# Altium project Asad's RGB Clock.PrjPcb
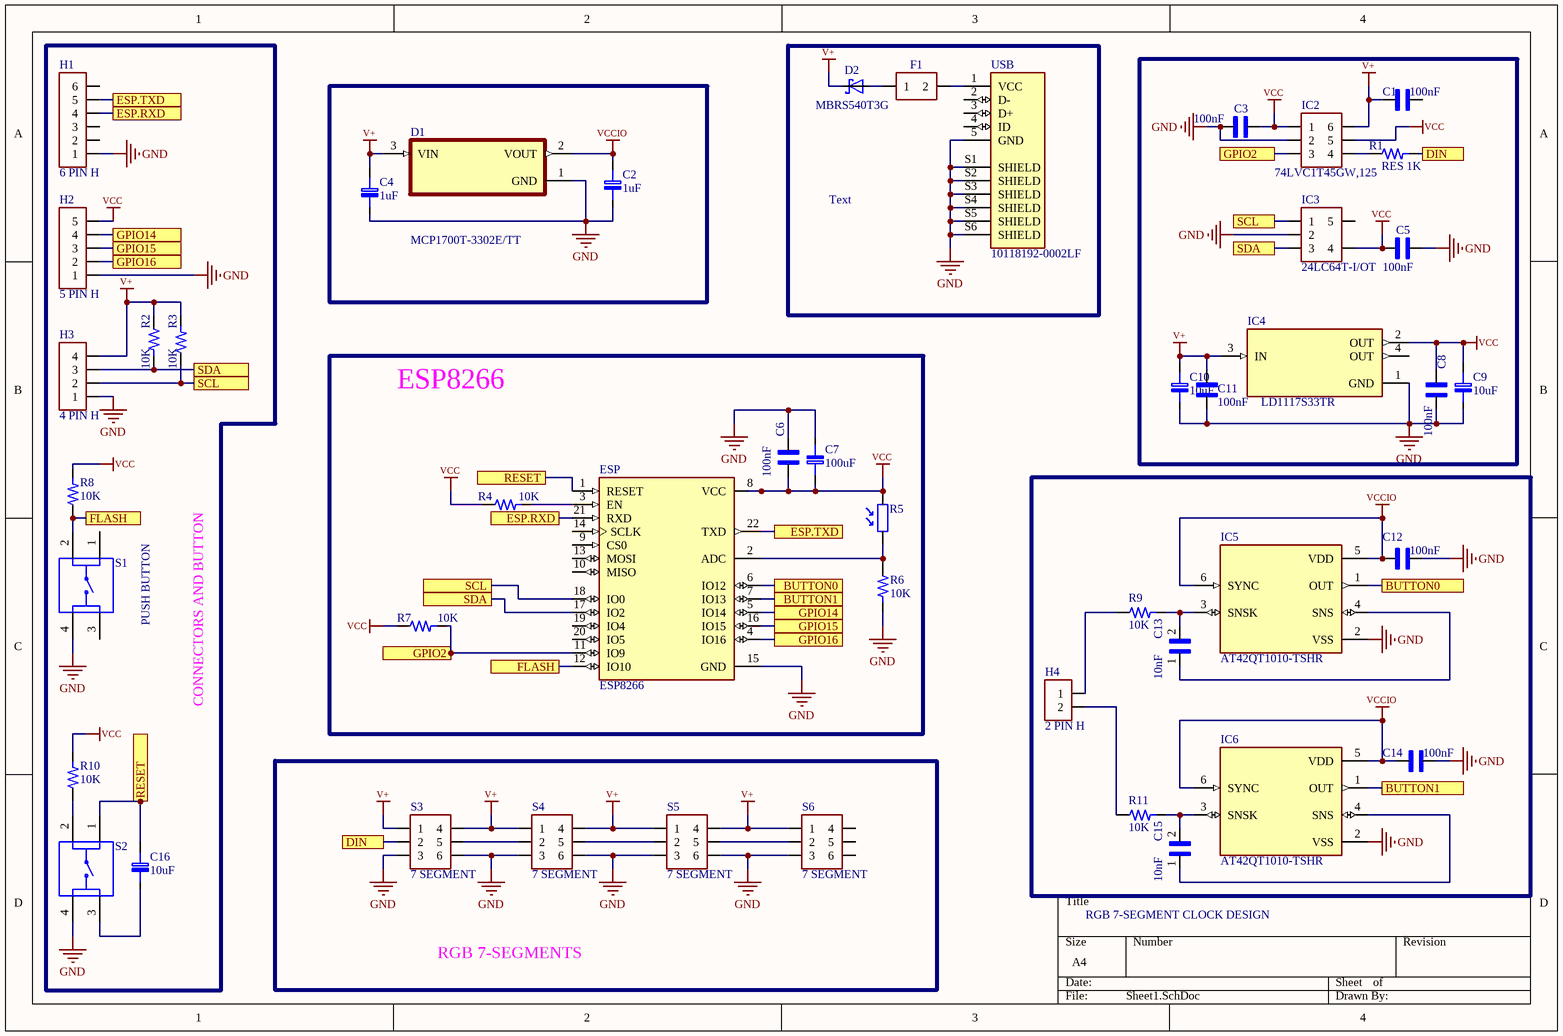
[diagram p0: Sheet1.SchDoc]
1 sheet, 47 parts. Net scope: flat (ports and power ports of the same name join across sheets).
Board file: PCB1.PcbDoc

## Sheet Sheet1.SchDoc
size A4

### Parts
C1  100nF  [CAP 0805]
C2  1uF  [CAP 0603]
C3  100nF  [CAP 0805]
C4  1uF  [CAP 0603]
C5  100nF  [CAP 0805]
C6  100nF  [CAP 0805]
C7  100uF  [CAP 2312]
C8  100nF  [CAP 0805]
C9  10uF  [CAP 1206]
C10  10uF  [CAP 1206]
C11  100nF  [CAP 0805]
C12  100nF  [CAP 0805]
C13  10nF  [CAP 0805]
C14  100nF  [CAP 0805]
C15  10nF  [CAP 0805]
C16  10uF  [CAP 1206]
D1  MCP1700T-3302E/TT  [MCP1700]
D2  MBRS540T3G  [MBRS50]
ESP  ESP8266  [ESP8266]
F1  MF-SMDF200-2  [MF-SMDF200-2]  (value not drawn)
H1  6 PIN H  [6 PIN H]
H2  5 PIN H  [5 PIN H]
H3  4 PIN H  [4 PIN H]
H4  2 PIN H  [2 PIN H]
IC2  74LVC1T45GW,125  [74LVC1T45GW,125]
IC3  24LC64T-I/OT  [24LC64T-I/OT]
IC4  LD1117S33TR  [LD1117S33TR]
IC5  AT42QT1010-TSHR  [AT42QT1010-TSHR]
IC6  AT42QT1010-TSHR  [AT42QT1010-TSHR]
R1  RES 1K  [RES 1206]
R2  10K  [RES 1206]
R3  10K  [RES 1206]
R4  10K  [RES 1206]
R5  NSL 19M51.  [NSL-19M51]  (value not drawn)
R6  10K  [RES 1206]
R7  10K  [RES 1206]
R8  10K  [RES 1206]
R9  10K  [RES 1206]
R10  10K  [RES 1206]
R11  10K  [RES 1206]
S1  PUSH BUTTON  [PUSH BUTTON]
S2  PUSH BUTTON  [PUSH BUTTON]  (value not drawn)
S3  7 SEGMENT  [7 SEGMENT]
S4  7 SEGMENT  [7 SEGMENT]
S5  7 SEGMENT  [7 SEGMENT]
S6  7 SEGMENT  [7 SEGMENT]
USB  10118192-0002LF  [10118192-0002LF]

### Ports
BUTTON0, BUTTON1, DIN, ESP.RXD, ESP.TXD, FLASH, GPIO2, GPIO14, GPIO15, GPIO16, RESET, SCL, SDA

### Nets
GND: C2.2 C3.1 C4.2 C5.2 C6.2 C7.2 C8.1 C9.2 C10.2 C11.1 C12.2 C14.2 D1.1(GND) ESP.15(GND) H1.1 H2.1 H3.1 IC2.2 IC3.2 IC4.1(GND) IC5.2(VSS) IC6.2(VSS) R6.2 S1.4 S2.4 S3.3 S3.6 S4.3 S4.6 S5.3 S5.6 S6.3 USB.5(GND) USB.S1(SHIELD) USB.S2(SHIELD) USB.S3(SHIELD) USB.S4(SHIELD) USB.S5(SHIELD) USB.S6(SHIELD)
V+: C1.1 C4.1 C10.1 C11.2 D1.3(VIN) D2.C H3.4 IC2.6 IC4.3(IN) R2.1 R3.2 S3.1 S3.4 S4.1 S4.4 S5.1 S5.4 S6.1
VCC: C3.2 C5.1 C6.1 C7.1 C8.2 C9.1 ESP.8(VCC) H2.5 IC2.1 IC2.5 IC3.4 IC4.2(OUT) R4.1 R5.2 R7.1 R8.2 R10.2
VCCIO: C2.1 C12.1 C14.1 D1.2(VOUT) IC5.5(VDD) IC5.6(SYNC) IC6.5(VDD) IC6.6(SYNC)
NetC13_1: C13.1 IC5.4(SNS)
NetC13_2: C13.2 IC5.3(SNSK) R9.2
NetC15_1: C15.1 IC6.4(SNS)
NetC15_2: C15.2 IC6.3(SNSK) R11.2
NetC16_1: C16.1 ESP.1(RESET) S2.1 ; port RESET
NetC16_2: C16.2 S2.3
NetD2_A: D2.A F1.1
NetESP_2: ESP.2(ADC) R5.1 R6.1
NetESP_3: ESP.3(EN) R4.2
NetESP_4: ESP.4(IO16) H2.2 ; port GPIO16
NetESP_5: ESP.5(IO14) H2.4 ; port GPIO14
NetESP_6: ESP.6(IO12) IC5.1(OUT) ; port BUTTON0
NetESP_7: ESP.7(IO13) IC6.1(OUT) ; port BUTTON1
NetESP_11: ESP.11(IO9) IC2.3 R7.2 ; port GPIO2
NetESP_12: ESP.12(IO10) R8.1 S1.2 ; port FLASH
NetESP_16: ESP.16(IO15) H2.3 ; port GPIO15
NetESP_17: ESP.17(IO2) H3.3 IC3.3 R2.2 ; port SDA
NetESP_18: ESP.18(IO0) H3.2 IC3.1 R3.1 ; port SCL
NetESP_21: ESP.21(RXD) H1.4 ; port ESP.RXD
NetESP_22: ESP.22(TXD) H1.5 ; port ESP.TXD
NetF1_2: F1.2 USB.1(VCC)
NetH4_1: H4.1 R9.1
NetH4_2: H4.2 R11.1
NetIC2_4: IC2.4 R1.1
NetR1_2: R1.2 S3.2 ; port DIN
NetR10_1: R10.1 S2.2
NetS3_5: S3.5 S4.2
NetS4_5: S4.5 S5.2
NetS5_5: S5.5 S6.2

Not connected (* = marked no-connect by the designer): C1 2; ESP 9(CS0) 10(MISO) 13(MOSI) 14(SCLK) 19(IO4) 20(IO5); H1 2 3 6; IC3 5; IC4 4(OUT); S1 1 3; S6 4 5 6; USB 2(D-) 3(D+) 4(ID)

### Notes on the sheet
- Text
- ESP8266
- CONNECTORS AND BUTTON
- RGB 7-SEGMENT CLOCK DESIGN
- RGB 7-SEGMENTS

### Library data of the parts
C1 C3 C5 C6 C8 C11 C12 C14 = CAP 100nF
C2 C4 = CAP 1 uF 50V: SAMSUNG ELECTRO-MECHANICS - CL21B105KBFNNNG - MLCC CAPACITORS; Material: Ceramic; Tolerance: 10%; Voltage Rating: 50V; Dielectric: X7R; Supplier 1: Digi-Key; Manufacturer: Samsung; Manufacturer Part Number: CL21B105KBFNNNG; RoHS: Yes; Category: Ceramic Capacitors; Stock 1: 1584886; Pricing 1: 1=0.12000, 10=0.08900, 50=0.05020, 100=0.04160, 500=0.02918, 1000=0.02416 (USD); Mount: Surface Mount; Case/Package: 0805; Case Code (Metric): 2012; Case Code (Imperial): 0805; Contact Plating: Tin; Min Operating Temperature: -55°C; Max Operating Temperature: 125°C; Packaging: Tape and Reel; Capacitance: 1uF; Package Quantity: 3000; Termination: Wraparound; Voltage: 50V; Series: CL; Construction: Flat; Length: 2mm; Width: 0.049inch; Thickness: 0.053inch; Depth: 1.25mm; RoHS Compliant: Yes; ComponentLink1URL: https://datasheet.ciiva.com/25733/cl21b105kbfnnng-25733278.pdf?src-supplier=Digi-Key; ComponentLink1Description: https://datasheet.ciiva.com/25733/cl21b105kbfnnng-25733278.pdf?src-supplier=Digi-Key; ComponentLink2URL: https://datasheet.ciiva.com/29199/455898-da-01-en-vs-kondensator-0805-29199201.pdf?src-supplier=Conrad; ComponentLink2Description: https://datasheet.ciiva.com/29199/455898-da-01-en-vs-kondensator-0805-29199201.pdf?src-supplier=Conrad; ComponentLink3URL: https://datasheet.ciiva.com/26310/mlcc-catalogdownload2013-eng-26310125.pdf?src-supplier=Distrelec; ComponentLink3Description: https://datasheet.ciiva.com/26310/mlcc-catalogdownload2013-eng-26310125.pdf?src-supplier=Distrelec; ComponentLink4URL: https://datasheet.ciiva.com/16428/cl05b104kq5nnnc-16428872.pdf?src-supplier=Future+Electronics; ComponentLink4Description: https://datasheet.ciiva.com/16428/cl05b104kq5nnnc-16428872.pdf?src-supplier=Future+Electronics; Supplier Part Number 1: 1276-6470-1-ND
C7 = CAP 100uF 16V: Cap Tant Solid 100uf 16V C Case (6.0x3.2x2.5mm) 10% SMD 200 mOhm 125C T/R; Manufacturer: KEMET; Manufacturer Part Number: T495C107K016ATE200; ESR (Equivalent Series Resistance): 200mR; Life (Hours): 2000Hour; Supplier 1: Digi-Key; RoHS: Yes; Category: Tantalum Capacitors; Stock 1: 4587; Pricing 1: 1=1.73000, 10=1.36900, 50=1.18600, 100=1.02640 (USD); Mount: Surface Mount; Case/Package: 2413; Case Code (Metric): 6032; Case Code (Imperial): 2413; Min Operating Temperature: -55°C; Max Operating Temperature: 125°C; Package Quantity: 1; Packaging: Cut Tape; Capacitance: 100uF; Tolerance: 10%; Voltage Rating: 16V; Voltage Rating (DC): 16V; Features: General Purpose; Length: 0.236inch; Width: 0.126inch; Height: 2.5mm; Height - Seated (Max): 0.11inch; Depth: 3.2mm; Radiation Hardening: No; REACH SVHC: Unknown; Lead Free: Lead Free; RoHS Compliant: Yes; ComponentLink1URL: http://www.farnell.com/datasheets/2373561.pdf?src-supplier=Farnell; ComponentLink1Description: http://www.farnell.com/datasheets/2373561.pdf?src-supplier=Farnell; ComponentLink2URL: http://www.farnell.com/datasheets/2758439.pdf?src-supplier=Newark; ComponentLink2Description: http://www.farnell.com/datasheets/2758439.pdf?src-supplier=Newark; ComponentLink3URL: http://www.farnell.com/datasheets/2015701.pdf?src-supplier=Element14; ComponentLink3Description: http://www.farnell.com/datasheets/2015701.pdf?src-supplier=Element14; ComponentLink4URL: http://www.farnell.com/datasheets/2373561.pdf?src-supplier=Newark; ComponentLink4Description: http://www.farnell.com/datasheets/2373561.pdf?src-supplier=Newark; ComponentLink5URL: https://api.kemet.com/component-edge/download/datasheet/T495C107K016ATE200.pdf?src-supplier=Digi-Key; ComponentLink5Description: https://api.kemet.com/component-edge/download/datasheet/T495C107K016ATE200.pdf?src-supplier=Digi-Key; ComponentLink6URL: http://capacitoredge.kemet.com/capedge2/DataSheet/Datasheet-T495C107K016ATE200.pdf?pn=T495C107K016ATE200&src-supplier=Avnet; ComponentLink6Description: http://capacitoredge.kemet.com/capedge2/DataSheet/Datasheet-T495C107K016ATE200.pdf?pn=T495C107K016ATE200&src-supplier=Avnet; Supplier Part Number 1: 399-11392-1-ND
C9 C10 C16 = CAP 10uF 10V: Cap Ceramic 10uF 10V X5R 10% SMD 1206 85C T/R; Manufacturer: Samsung; Manufacturer Part Number: CL31A106KPHNNNE; Supplier 1: Digi-Key; RoHS: Yes; Category: Ceramic Capacitors; Stock 1: 176788; Pricing 1: 1=0.23000, 10=0.15900, 50=0.09540, 100=0.08060, 500=0.05516, 1000=0.04880 (USD); Mount: Surface Mount; Case/Package: 1206; Case Code (Metric): 3216; Case Code (Imperial): 1206; Contact Plating: Tin; Min Operating Temperature: -55°C; Max Operating Temperature: 85°C; Packaging: Tape and Reel; Capacitance: 10uF; Tolerance: 10%; Voltage Rating: 10V; Dielectric: X5R; Series: CL; Construction: Flat; Length: 3.2mm; Width: 0.063inch; Height: 1.6mm; Thickness: 0.071inch; Depth: 1.6mm; Radiation Hardening: No; RoHS Compliant: Yes; ComponentLink1URL: https://datasheet.ciiva.com/15195/getdatasheetpartid-357468-15195994.pdf?src-supplier=Verical; ComponentLink1Description: https://datasheet.ciiva.com/15195/getdatasheetpartid-357468-15195994.pdf?src-supplier=Verical; ComponentLink2URL: https://datasheet.ciiva.com/16224/cl31a106kphnnne-16224988.pdf?src-supplier=Future+Electronics; ComponentLink2Description: https://datasheet.ciiva.com/16224/cl31a106kphnnne-16224988.pdf?src-supplier=Future+Electronics; Supplier Part Number 1: 1276-1148-1-ND
C13 C15 = CAP 10nF 50V: SAMSUNG ELECTRO-MECHANICS - CL21B103KBANNNC - SMD Vícevrstvý Keramický Kondenzátor, 10000 pF, 50 V, 0805 [2012 Metrické], ± 10%, X7R, CL Series; Material: Ceramic; Voltage Rating (DC): 50V; Supplier 1: Digi-Key; Manufacturer: Samsung; Manufacturer Part Number: CL21B103KBANNNC; RoHS: Yes; Category: Ceramic Capacitors; Stock 1: 930321; Pricing 1: 1=0.10000, 10=0.04700, 50=0.02560, 100=0.02100, 500=0.01498, 1000=0.01176 (USD); Mount: Surface Mount; Case/Package: 0805; Case Code (Metric): 2012; Case Code (Imperial): 0805; Contact Plating: Tin; Min Operating Temperature: -55°C; Max Operating Temperature: 125°C; Capacitance: 10nF; Tolerance: 10%; Dielectric: X7R; Voltage: 50V; Packaging: Tape and Reel; Voltage Rating: 50V; Series: CL; Construction: Flat; Length: 2mm; Width: 0.049inch; Height: 0.65mm; Depth: 1.25mm; Thickness: 0.03inch; Radiation Hardening: No; Lead Free: Lead Free; RoHS Compliant: Yes; ComponentLink1URL: https://datasheet.ciiva.com/25709/cl21b103kbannnc-25709781.pdf?src-supplier=Digi-Key; ComponentLink1Description: https://datasheet.ciiva.com/25709/cl21b103kbannnc-25709781.pdf?src-supplier=Digi-Key; ComponentLink2URL: https://datasheet.ciiva.com/29199/455082-da-01-en-vs-kondensator-0805-29199459.pdf?src-supplier=Conrad; ComponentLink2Description: https://datasheet.ciiva.com/29199/455082-da-01-en-vs-kondensator-0805-29199459.pdf?src-supplier=Conrad; Supplier Part Number 1: 1276-1015-1-ND
D1 = MCP1700T-3302E/TT: Pwr Sply Func; Voltage Regulator; LDO; SOT-23; PD 369.6mW; VO 3.3V; Regline +/-0.75%/V; Manufacturer: Microchip; Number of Outputs: 1; Min Input Voltage: 2.3V; Max Input Voltage: 6V; Dropout Voltage: 178mV; Output Current: 250mA; Input Bias Current: 1.6uA; Polarity: Positive; Quiescent Current: 4uA; Accuracy: 2%; Output Type: Fixed; Supplier 1: RSComponents; Manufacturer Part Number: MCP1700T-3302E/TT; RoHS: Yes; Category: Voltage Regulators - Linear; Stock 1: 1170; Pricing 1: 1=0.40600 (USD); Mount: Surface Mount; Case/Package: SOT-23; Number of Pins: 3; Contact Plating: Tin,Matte; Min Operating Temperature: -40°C; Max Operating Temperature: 125°C; Nominal Output Voltage: 3.3V; Packaging: Tape and Reel; Output Voltage: 3.3V; Max Output Current: 250mA; Max Supply Voltage: 6V; Min Supply Voltage: 2.3V; Package Quantity: 3000; Max Power Dissipation: 369.6mW; Min Output Voltage: 3.3V; Max Output Voltage: 3.3V; Termination: SMD/SMT; Output Voltage Accuracy: 2%; Nominal Supply Current: 4uA; Power Dissipation: 369.6mW; Length: 2.9mm; Width: 1.3mm; Height: 0.95mm; Radiation Hardening: No; REACH SVHC: No SVHC; Lead Free: Lead Free; ComponentLink1URL: https://datasheet.ciiva.com/2040/21826b-2040112.pdf?src-supplier=Digi-Key; ComponentLink1Description: https://datasheet.ciiva.com/2040/21826b-2040112.pdf?src-supplier=Digi-Key; ComponentLink2URL: https://datasheet.ciiva.com/5801/1784514-5801824.pdf?src-supplier=Farnell; ComponentLink2Description: https://datasheet.ciiva.com/5801/1784514-5801824.pdf?src-supplier=Farnell; ComponentLink3URL: https://datasheet.ciiva.com/2040/21826b-2040113.pdf?src-supplier=Digi-Key; ComponentLink3Description: https://datasheet.ciiva.com/2040/21826b-2040113.pdf?src-supplier=Digi-Key; ComponentLink4URL: https://datasheet.ciiva.com/2040/21826b-2040114.pdf?src-supplier=Digi-Key; ComponentLink4Description: https://datasheet.ciiva.com/2040/21826b-2040114.pdf?src-supplier=Digi-Key; ComponentLink5URL: https://datasheet.ciiva.com/3224/jp011779-3224133.pdf?src-supplier=Avnet; ComponentLink5Description: https://datasheet.ciiva.com/3224/jp011779-3224133.pdf?src-supplier=Avnet; ComponentLink6URL: https://datasheet.ciiva.com/7649/1784514-7649813.pdf?src-supplier=Element14; ComponentLink6Description: https://datasheet.ciiva.com/7649/1784514-7649813.pdf?src-supplier=Element14; ComponentLink7URL: https://datasheet.ciiva.com/15200/getdatasheetpartid-453599-15200229.pdf?src-supplier=Verical; ComponentLink7Description: https://datasheet.ciiva.com/15200/getdatasheetpartid-453599-15200229.pdf?src-supplier=Verical; ComponentLink8URL: https://datasheet.ciiva.com/17364/jp011779-17364263.pdf?src-supplier=Avnet+Europe; ComponentLink8Description: https://datasheet.ciiva.com/17364/jp011779-17364263.pdf?src-supplier=Avnet+Europe; ComponentLink9URL: https://datasheet.ciiva.com/14150/mcp1700-eng-tds-14150122.pdf?src-supplier=Distrelec; ComponentLink9Description: https://datasheet.ciiva.com/14150/mcp1700-eng-tds-14150122.pdf?src-supplier=Distrelec; ComponentLink10URL: https://datasheet.ciiva.com/22710/1784514-22710988.pdf?src-supplier=Element14; ComponentLink10Description: https://datasheet.ciiva.com/22710/1784514-22710988.pdf?src-supplier=Element14; ComponentLink11URL: https://datasheet.ciiva.com/29305/651414-da-01-en-ic-reg-ld-mcp1700t-3302e-tt-sot-23-3-mcp-29305258.pdf?src-supplier=Conrad; ComponentLink11Description: https://datasheet.ciiva.com/29305/651414-da-01-en-ic-reg-ld-mcp1700t-3302e-tt-sot-23-3-mcp-29305258.pdf?src-supplier=Conrad; Supplier Part Number 1: 6989044P
D2 = MBRS540T3G: ON SEMICONDUCTOR - MBRS540T3G - Schottky Rectifier, 40 V, 5 A, Single, DO-214AB (SMC), 2 Pins, 500 mV; Max Surge Current: 190A; Forward Current: 5A; Max Reverse Current: 300uA; Forward Voltage: 500mV; Max Repetitive Reverse Voltage (Vrrm): 40V; Polarity: Standard; Supplier 1: Newark; Manufacturer: ON Semiconductor; Manufacturer Part Number: MBRS540T3G; RoHS: Yes; Category: Rectifier Diodes; Stock 1: 89; Pricing 1: 5=0.51800, 10=0.44800, 100=0.31900, 500=0.25500 (USD); Case/Package: SMC; Number of Pins: 2; Contact Plating: Tin,Matte; Min Operating Temperature: -65°C; Max Operating Temperature: 150°C; Package Quantity: 2500; Packaging: Tape and Reel; Average Rectified Current: 5A; Max Reverse Leakage Current: 300uA; Max Forward Surge Current (Ifsm): 190A; Peak Non-Repetitive Surge Current: 190A; Element Configuration: Single; Voltage Rating (DC): 40V; Current Rating: 5A; Output Current: 5A; Max Reverse Voltage (DC): 40V; Series: -; Length: 0.279inch; Width: 0.24inch; Height: 0.095inch; Radiation Hardening: No; REACH SVHC: No SVHC; Lead Free: Lead Free; Halogen Free: Halogen Free; RoHS Compliant: Yes; ComponentLink1URL: https://datasheet.ciiva.com/916/mbrs540t3-d-916082.pdf?src-supplier=Digi-Key; ComponentLink1Description: https://datasheet.ciiva.com/916/mbrs540t3-d-916082.pdf?src-supplier=Digi-Key; ComponentLink2URL: https://datasheet.ciiva.com/16225/mbrs540t3-d-16225604.pdf?src-supplier=Future+Electronics; ComponentLink2Description: https://datasheet.ciiva.com/16225/mbrs540t3-d-16225604.pdf?src-supplier=Future+Electronics; ComponentLink3URL: https://datasheet.ciiva.com/22659/1708285-22659081.pdf?src-supplier=Element14; ComponentLink3Description: https://datasheet.ciiva.com/22659/1708285-22659081.pdf?src-supplier=Element14; ComponentLink4URL: https://datasheet.ciiva.com/916/mbrs540t3-d-916083.pdf?src-supplier=Digi-Key; ComponentLink4Description: https://datasheet.ciiva.com/916/mbrs540t3-d-916083.pdf?src-supplier=Digi-Key; ComponentLink5URL: https://datasheet.ciiva.com/916/mbrs540t3-d-916084.pdf?src-supplier=Digi-Key; ComponentLink5Description: https://datasheet.ciiva.com/916/mbrs540t3-d-916084.pdf?src-supplier=Digi-Key; ComponentLink6URL: https://datasheet.ciiva.com/5763/mbrs540t3-d-5763253.pdf?src-supplier=Farnell; ComponentLink6Description: https://datasheet.ciiva.com/5763/mbrs540t3-d-5763253.pdf?src-supplier=Farnell; ComponentLink7URL: https://datasheet.ciiva.com/29883/mbrs540t3-d-29883735.pdf?src-supplier=Avnet; ComponentLink7Description: https://datasheet.ciiva.com/29883/mbrs540t3-d-29883735.pdf?src-supplier=Avnet; ComponentLink8URL: https://datasheet.ciiva.com/8299/mbrs540t3-d-8299865.pdf?src-supplier=Avnet; ComponentLink8Description: https://datasheet.ciiva.com/8299/mbrs540t3-d-8299865.pdf?src-supplier=Avnet; ComponentLink9URL: https://datasheet.ciiva.com/25948/mbrs540t3-d-25948171.pdf?src-supplier=Avnet+Europe; ComponentLink9Description: https://datasheet.ciiva.com/25948/mbrs540t3-d-25948171.pdf?src-supplier=Avnet+Europe; ComponentLink10URL: https://datasheet.ciiva.com/15144/getdatasheetpartid-40347-15144093.pdf?src-supplier=Verical; ComponentLink10Description: https://datasheet.ciiva.com/15144/getdatasheetpartid-40347-15144093.pdf?src-supplier=Verical; Supplier Part Number 1: 94T5861
F1 = MF-SMDF200-2: BOURNS         MF-SMDF200-2             FUSE, RESETTABLE PTC, 10V, 2A, SMD; Max Current Rating: 40A; Resistance: 100mR; Power Dissipation: 1.1W; Trip Current: 4A; Time to Trip: 2.7s; Approvals: UL,CSA,TUV; Supplier 1: Digi-Key; Manufacturer: Bourns; Manufacturer Part Number: MF-SMDF200-2; RoHS: Yes; Category: PTC Resettable Fuses; Stock 1: 4493; Pricing 1: 1=0.67000, 5=0.65000, 10=0.63000, 50=0.53000, 100=0.44000, 250=0.40000, 500=0.34000, 1000=0.30000 (USD); Case/Package: 2018; Case Code (Metric): 5045; Case Code (Imperial): 2018; Min Operating Temperature: -40°C; Max Operating Temperature: 85°C; Packaging: Tape and Reel; Operating Supply Voltage: 10V; Package Quantity: 6000; Current Rating: 40A; Voltage Rating: 10V; Termination: SMD/SMT; Hold Current: 2A; Voltage Rating (DC): 10V; Series: MF-SMDF; Radiation Hardening: No; REACH SVHC: No SVHC; RoHS Compliant: Yes; ComponentLink1URL: https://datasheet.ciiva.com/327/mfsmdf2-327988.pdf?src-supplier=Digi-Key; ComponentLink1Description: https://datasheet.ciiva.com/327/mfsmdf2-327988.pdf?src-supplier=Digi-Key; ComponentLink2URL: https://datasheet.ciiva.com/3020/mfsmdf2-3020610.pdf?src-supplier=Avnet; ComponentLink2Description: https://datasheet.ciiva.com/3020/mfsmdf2-3020610.pdf?src-supplier=Avnet; ComponentLink3URL: https://datasheet.ciiva.com/327/mfsmdf2-327989.pdf?src-supplier=Digi-Key; ComponentLink3Description: https://datasheet.ciiva.com/327/mfsmdf2-327989.pdf?src-supplier=Digi-Key; ComponentLink4URL: https://datasheet.ciiva.com/327/mfsmdf2-327990.pdf?src-supplier=Digi-Key; ComponentLink4Description: https://datasheet.ciiva.com/327/mfsmdf2-327990.pdf?src-supplier=Digi-Key; ComponentLink5URL: https://datasheet.ciiva.com/32438/mf-smdf-series-eng-tds-32438743.pdf?src-supplier=Distrelec; ComponentLink5Description: https://datasheet.ciiva.com/32438/mf-smdf-series-eng-tds-32438743.pdf?src-supplier=Distrelec; ComponentLink6URL: https://datasheet.ciiva.com/17414/mfsmdf2-17414504.pdf?src-supplier=Avnet+Europe; ComponentLink6Description: https://datasheet.ciiva.com/17414/mfsmdf2-17414504.pdf?src-supplier=Avnet+Europe; Supplier Part Number 1: MF-SMDF200-2CT-ND
IC2 = 74LVC1T45GW,125: 74LVC1T45; 74LVCH1T45 - Dual supply translating transceiver; 3-state; Manufacturer: Nexperia; Supplier 1: Newark; Manufacturer Part Number: 74LVC1T45GW,125; RoHS: Yes; Category: Voltage Level Shifters; Stock 1: 9; Pricing 1: 5=0.50000, 10=0.40500, 25=0.37000, 50=0.32300, 100=0.27500, 250=0.25000 (USD); RoHS Compliant: Yes; ComponentLink1URL: http://www.farnell.com/datasheets/1645592.pdf?src-supplier=Farnell; ComponentLink1Description: http://www.farnell.com/datasheets/1645592.pdf?src-supplier=Farnell; ComponentLink2URL: https://assets.nexperia.com/documents/data-sheet/74LVC_LVCH1T45.pdf?src-supplier=Digi-Key; ComponentLink2Description: https://assets.nexperia.com/documents/data-sheet/74LVC_LVCH1T45.pdf?src-supplier=Digi-Key; Supplier Part Number 1: 55W4712
IC3 = 24LC64T-I/OT: EEPROM Serial-I2C 64K-bit 8K x 8 3.3V/5V 5-Pin SOT-23 T/R; Manufacturer: Microchip; Min Supply Voltage: 2.5V; Max Supply Voltage: 5.5V; Interface: I2C,Serial; Frequency: 400kHz; Access Time: 900ns; Density: 64Kb; Nominal Supply Current: 3mA; Operating Supply Voltage: 5V; Supplier 1: Newark; Manufacturer Part Number: 24LC64T-I/OT; RoHS: Yes; Category: EEPROM; Stock 1: 35191; Pricing 1: 1=0.47500, 10=0.46900, 25=0.46300, 50=0.45000, 100=0.43800 (USD); Mount: Surface Mount; Case/Package: SOT-23; Number of Pins: 5; Contact Plating: Tin,Matte; Min Operating Temperature: -40°C; Max Operating Temperature: 85°C; Packaging: Tape and Reel; Package Quantity: 3000; Memory Type: EEPROM; Memory Size: 64Kb; Termination: SMD/SMT; Max Frequency: 400kHz; Length: 3.1mm; Width: 1.8mm; Height: 1.3mm; Radiation Hardening: No; REACH SVHC: No SVHC; Lead Free: Lead Free; ComponentLink1URL: https://datasheet.ciiva.com/15123/getdatasheetpartid-765483-15123763.pdf?src-supplier=Verical; ComponentLink1Description: https://datasheet.ciiva.com/15123/getdatasheetpartid-765483-15123763.pdf?src-supplier=Verical; ComponentLink2URL: https://datasheet.ciiva.com/1155/1688094-1155350.pdf?src-supplier=Element14; ComponentLink2Description: https://datasheet.ciiva.com/1155/1688094-1155350.pdf?src-supplier=Element14; ComponentLink3URL: https://datasheet.ciiva.com/16622/21189r-16622582.pdf?src-supplier=Avnet+Europe; ComponentLink3Description: https://datasheet.ciiva.com/16622/21189r-16622582.pdf?src-supplier=Avnet+Europe; ComponentLink4URL: https://datasheet.ciiva.com/3185/21189r-3185335.pdf?src-supplier=Avnet; ComponentLink4Description: https://datasheet.ciiva.com/3185/21189r-3185335.pdf?src-supplier=Avnet; ComponentLink5URL: https://datasheet.ciiva.com/4858/21189l-21989-4858953.pdf?src-supplier=Mouser; ComponentLink5Description: https://datasheet.ciiva.com/4858/21189l-21989-4858953.pdf?src-supplier=Mouser; ComponentLink6URL: https://datasheet.ciiva.com/14134/24aa64-24lc64-24fc64-eng-tds-14134845.pdf?src-supplier=Distrelec; ComponentLink6Description: https://datasheet.ciiva.com/14134/24aa64-24lc64-24fc64-eng-tds-14134845.pdf?src-supplier=Distrelec; ComponentLink7URL: https://datasheet.ciiva.com/16226/filehandler-aspxddocname-en011843-16226797.pdf?src-supplier=Future+Electronics; ComponentLink7Description: https://datasheet.ciiva.com/16226/filehandler-aspxddocname-en011843-16226797.pdf?src-supplier=Future+Electronics; Supplier Part Number 1: 05R8364
IC4 = LD1117S33TR: STMICROELECTRONICS   LD1117S33TR.   LDO VOLTAGE REGULATOR, 3.3V, 0.8A, SOT-223-3; Max Power Dissipation: 12W; Dropout Voltage: 1.1V; Number of Outputs: 1; Max Input Voltage: 15V; Max Output Current: 1.3A; Output Current: 800mA; Min Input Voltage: 4.75V; Input Bias Current: 5mA; Quiescent Current: 10mA; Polarity: Positive; Accuracy: 1%; Output Type: Fixed; Supplier 1: Digi-Key; Manufacturer: STMicroelectronics; Manufacturer Part Number: LD1117S33TR; RoHS: Yes; Category: Voltage Regulators - Linear; Stock 1: 8464; Pricing 1: 1=0.46000, 10=0.39000, 25=0.36440, 100=0.29150, 250=0.27064, 500=0.22900, 1000=0.17696 (USD); Mount: Surface Mount; Case/Package: SOT-223; Number of Pins: 4; Weight: 0.01lb; Contact Plating: Tin,Matte; Min Operating Temperature: 0°C; Max Operating Temperature: 125°C; Packaging: Tape and Reel; Package Quantity: 1; Series: -; Output Voltage: 3.3V; Max Supply Voltage: 15V; Min Supply Voltage: 4.75V; Nominal Output Voltage: 3.3V; Number of Regulators: 1; Power Dissipation: 12W; Min Output Voltage: 3.3V; Max Output Voltage: 3.3V; Termination: SMD/SMT; Voltage: 3.3V; Output Voltage Accuracy: 1%; Length: 6.5mm; Width: 3.5mm; Height: 1.8mm; Radiation Hardening: No; RoHS Compliant: Yes; Lead Free: Lead Free; REACH SVHC: No SVHC; ComponentLink1URL: https://datasheet.ciiva.com/19478/1390240-19478097.pdf?src-supplier=Jameco; ComponentLink1Description: https://datasheet.ciiva.com/19478/1390240-19478097.pdf?src-supplier=Jameco; ComponentLink2URL: https://datasheet.ciiva.com/1511/1776449-1511573.pdf?src-supplier=Element14; ComponentLink2Description: https://datasheet.ciiva.com/1511/1776449-1511573.pdf?src-supplier=Element14; ComponentLink3URL: https://datasheet.ciiva.com/2041/cd00000544-2041941.pdf?src-supplier=Digi-Key; ComponentLink3Description: https://datasheet.ciiva.com/2041/cd00000544-2041941.pdf?src-supplier=Digi-Key; ComponentLink4URL: https://datasheet.ciiva.com/2041/cd00000544-2041942.pdf?src-supplier=Digi-Key; ComponentLink4Description: https://datasheet.ciiva.com/2041/cd00000544-2041942.pdf?src-supplier=Digi-Key; ComponentLink5URL: https://datasheet.ciiva.com/2041/cd00000544-2041943.pdf?src-supplier=Digi-Key; ComponentLink5Description: https://datasheet.ciiva.com/2041/cd00000544-2041943.pdf?src-supplier=Digi-Key; ComponentLink6URL: https://datasheet.ciiva.com/16396/cd00000544-16396459.pdf?src-supplier=Future+Electronics; ComponentLink6Description: https://datasheet.ciiva.com/16396/cd00000544-16396459.pdf?src-supplier=Future+Electronics; ComponentLink7URL: https://datasheet.ciiva.com/7992/1776449-7992621.pdf?src-supplier=Element14; ComponentLink7Description: https://datasheet.ciiva.com/7992/1776449-7992621.pdf?src-supplier=Element14; ComponentLink8URL: https://datasheet.ciiva.com/28652/1776449-28652462.pdf?src-supplier=Element14; ComponentLink8Description: https://datasheet.ciiva.com/28652/1776449-28652462.pdf?src-supplier=Element14; Supplier Part Number 1: 497-1242-1-ND
IC5 IC6 = AT42QT1010-TSHR: ATMEL         AT42QT1010-TSHR             Capacitive Touch Sensor, QTouch, 1.8 V, 5.5 V, SOT-23, 6 Pins, -40 C; Manufacturer: Microchip / Atmel; Operating Supply Current: 729uA; Resolution: 14b; Interface: Serial; Number of Inputs: 1; Load Capacitance: 20pF; Min Supply Voltage: 1.8V; Max Supply Voltage: 5.5V; Output Type: DIGITAL OUTPUT; Supplier 1: RSComponents; Manufacturer Part Number: AT42QT1010-TSHR; RoHS: Yes; Category: Uncategorized; Stock 1: 180; Pricing 1: 10=0.62900, 30=0.61000, 100=0.59100 (USD); Mount: Surface Mount; Case/Package: SOT-23-6; Number of Pins: 6; Min Operating Temperature: -40°C; Max Operating Temperature: 85°C; Packaging: Tape and Reel; Package Quantity: 4500; Nominal Supply Current: 729uA; Number of Channels: 1; Touchscreen: Capacitive; Sensing Method: Capacitive; Series: QTouch™; Supply Current: 729uA; Length: 3mm; Width: 1.75mm; Height: 1.3mm; REACH SVHC: No SVHC; Lead Free: Lead Free; RoHS Compliant: Yes; ComponentLink1URL: https://datasheet.ciiva.com/15098/getdatasheetpartid-364797-15098928.pdf?src-supplier=Verical; ComponentLink1Description: https://datasheet.ciiva.com/15098/getdatasheetpartid-364797-15098928.pdf?src-supplier=Verical; ComponentLink2URL: https://datasheet.ciiva.com/1165/atmel-9541-at42-qtouch-bsw-at42qt1010-datasheet-1165684.pdf?src-supplier=Element14; ComponentLink2Description: https://datasheet.ciiva.com/1165/atmel-9541-at42-qtouch-bsw-at42qt1010-datasheet-1165684.pdf?src-supplier=Element14; ComponentLink3URL: https://datasheet.ciiva.com/29124/doc8287-29124726.pdf?src-supplier=Digi-Key; ComponentLink3Description: https://datasheet.ciiva.com/29124/doc8287-29124726.pdf?src-supplier=Digi-Key; ComponentLink4URL: https://datasheet.ciiva.com/14094/at42qt1010-eng-tds-14094871.pdf?src-supplier=Distrelec; ComponentLink4Description: https://datasheet.ciiva.com/14094/at42qt1010-eng-tds-14094871.pdf?src-supplier=Distrelec; ComponentLink5URL: https://datasheet.ciiva.com/29124/doc8287-29124727.pdf?src-supplier=Digi-Key; ComponentLink5Description: https://datasheet.ciiva.com/29124/doc8287-29124727.pdf?src-supplier=Digi-Key; ComponentLink6URL: https://datasheet.ciiva.com/29124/doc8287-29124728.pdf?src-supplier=Digi-Key; ComponentLink6Description: https://datasheet.ciiva.com/29124/doc8287-29124728.pdf?src-supplier=Digi-Key; Supplier Part Number 1: 1276595P
R5 = NSL 19M51.: ADVANCED PHOTONIX         NSL 19M51.            LIGHT DEPENDENT RESISTOR,550NM,TO-18; Power Rating: 50mW; Voltage Rating: 100V; Lead Diameter: 0.4mm; Lead Length: 36mm; Supplier 1: Digi-Key; Manufacturer: Advanced Photonix; Manufacturer Part Number: NSL 19M51.; RoHS: Yes; Category: Uncategorized; Stock 1: 17728; Pricing 1: 1=1.07000, 5=1.02000, 10=0.88800, 25=0.78000, 50=0.64800, 100=0.55200, 500=0.48000, 1000=0.42000, 5000=0.37200 (USD); Case/Package: TO-18; Number of Pins: 2; Min Operating Temperature: -60°C; Max Operating Temperature: 75°C; Voltage Rating (DC): 100V; Resistor Type: Ceramic; REACH SVHC: Unknown; ComponentLink1URL: http://www.farnell.com/datasheets/77395.pdf?src-supplier=Farnell; ComponentLink1Description: http://www.farnell.com/datasheets/77395.pdf?src-supplier=Farnell; ComponentLink2URL: http://www.farnell.com/datasheets/77395.pdf?src-supplier=Element14; ComponentLink2Description: http://www.farnell.com/datasheets/77395.pdf?src-supplier=Element14; Supplier Part Number 1: NSL-19M51-ND
R9 R11 = RES 10K
USB = 10118192-0002LF: Manufacturer: Amphenol ICC / FCI; Supplier 1: Digi-Key; Manufacturer Part Number: 10118192-0002LF; RoHS: No; Stock 1: 42230; Pricing 1: 1=0.46000, 10=0.44000, 25=0.37680, 50=0.32040, 100=0.30780, 250=0.27640, 500=0.26386 (USD); Supplier Part Number 1: 609-5379-1-ND